# EAGLE design Wind_enc (EAGLE 6.3)
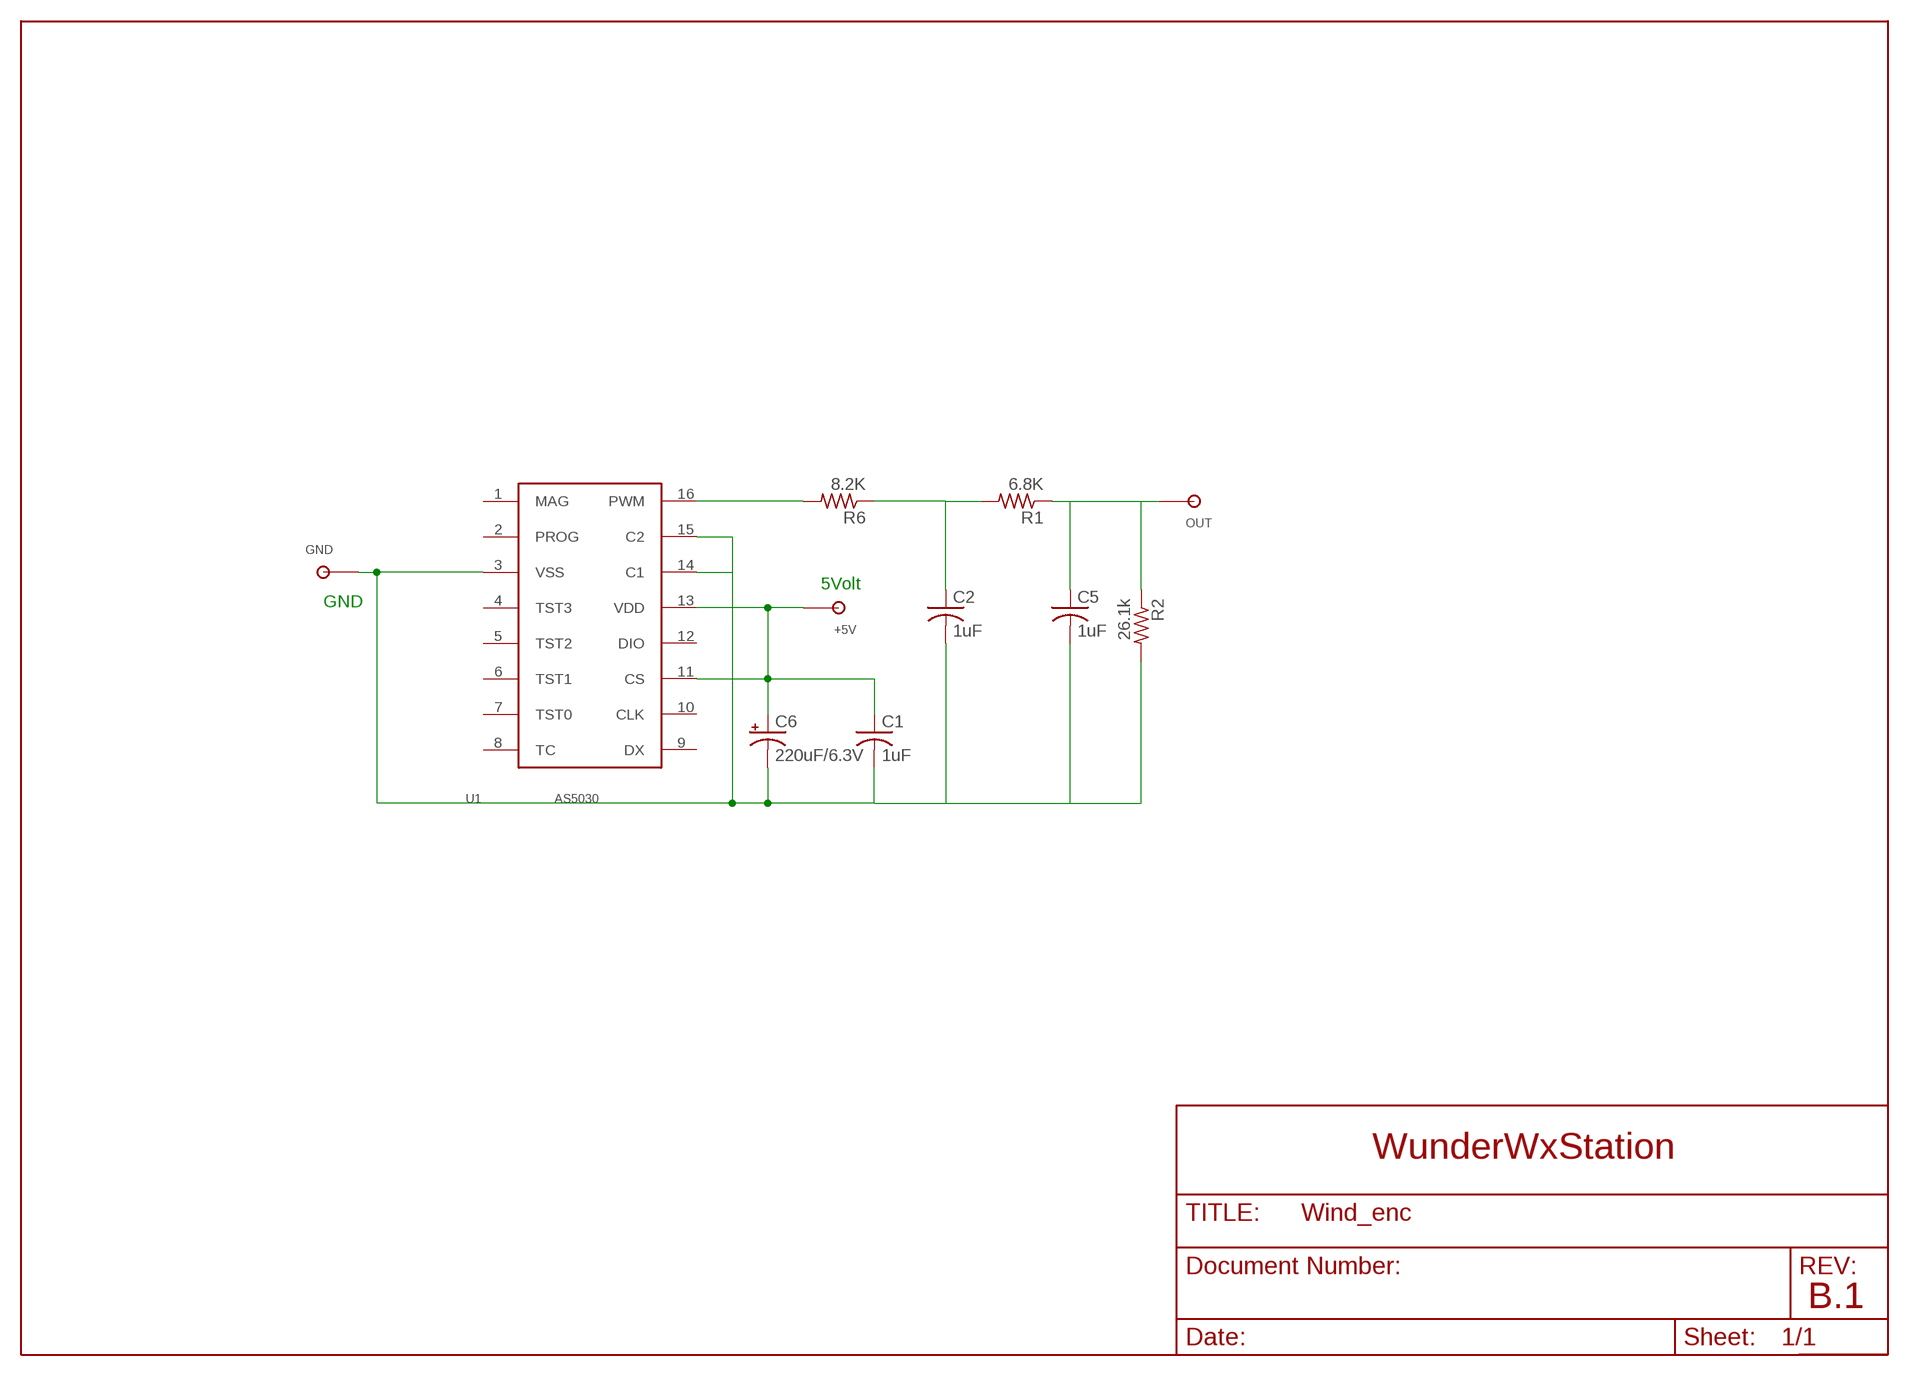
[diagram p0: schematic, sheet 1]

## Parts
+5V  TPSOL  [TP_SOL]
C1  1uF  C-USC0805K  [C0805K]
C2  1uF  C-USC0805K  [C0805K]
C5  1uF  C-USC0805K  [C0805K]
C6  220uF/6.3V  CPOL-USSMCD  [SMC_D]
GND  TPSOL  [TP_SOL]
OUT  TPSOL  [TP_SOL]
R1  6.8K  R-US_R0603  [R0603]
R2  26.1k  R-US_R0603  [R0603]
R6  8.2K  R-US_R0603  [R0603]
U1  AS5030  [TSSOP16]

## Nets
N$1: +5V.P$1 C1.1 C6.+ U1.11(CS) U1.13(VDD)
N$2: C1.2 C2.2 C5.2 C6.- GND.P$1 R2.2 U1.3(VSS) U1.14(C1) U1.15(C2)
N$3: C5.1 OUT.P$1 R1.1 R2.1
N$22: C2.1 R1.2 R6.1
N$23: R6.2 U1.16(PWM)
Unconnected: U1.1(MAG) U1.2(PROG) U1.4(TST3) U1.5(TST2) U1.6(TST1) U1.7(TST0) U1.8(TC) U1.9(DX) U1.10(CLK) U1.12(DIO)

## Notes on the sheet
- 5Volt
- GND
- WunderWxStation
- B.1

## Library data of the parts
+5V GND OUT = wifi_WX:TP
C1 C2 C5 = rcl:C-US: CAPACITOR, American symbol
C6 = rcl:CPOL-US: POLARIZED CAPACITOR, American symbol
R1 R2 R6 = rcl:R-US_: RESISTOR, American symbol
U1 = Stofer:AS5030

## Board
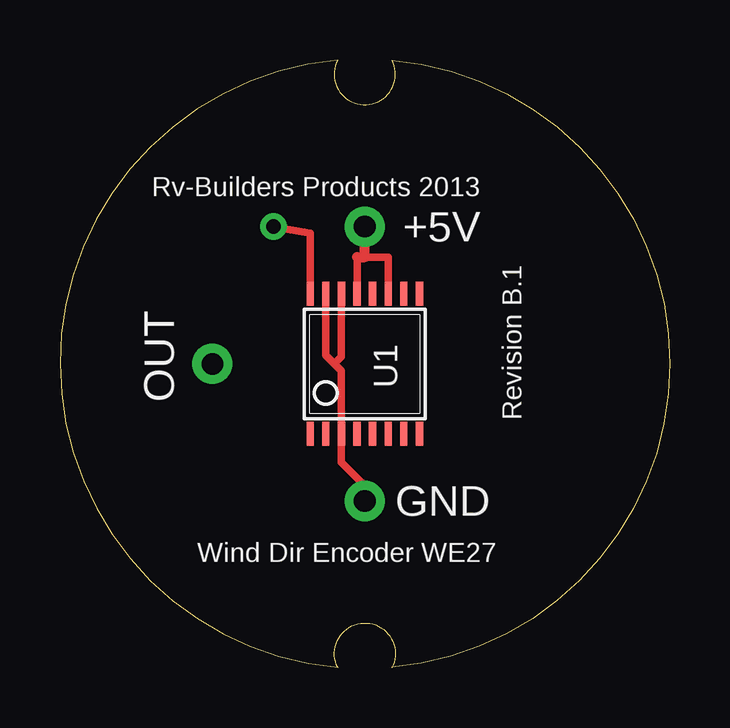
[diagram p1: board, top side]
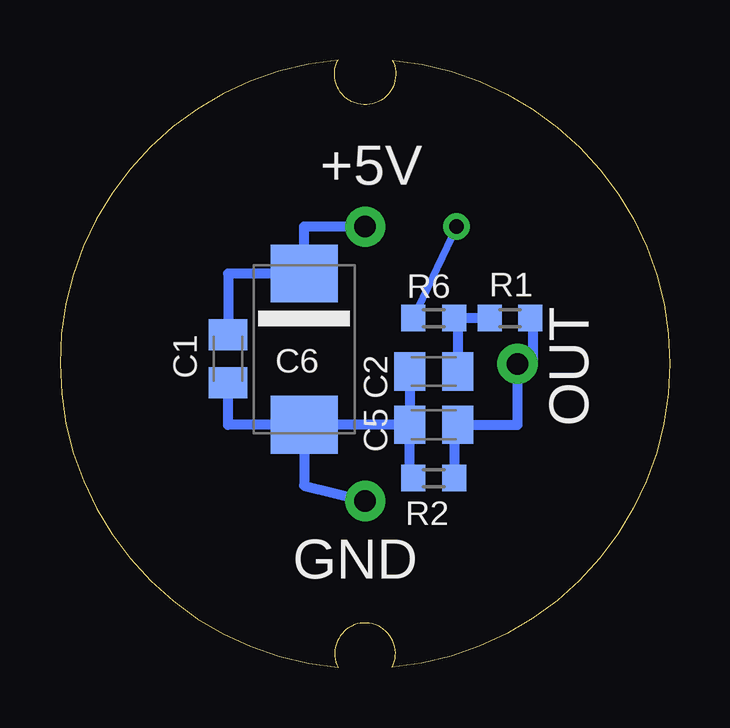
[diagram p2: board, bottom side, seen from below]

Size 25.41 x 25.32 mm. Coordinates in mm from the lower left corner, seen from the top.
Outline: 11.57,25.32 arc170 11.58,0.02
Outline: 11.57,25.32 arc235 13.83,25.32
Outline: 13.83,25.32 arc-170 13.82,0.01
Outline: 11.57,0.02 arc-235 13.83,0
Copper layers (1*16): Top 0.035mm / dielectric 1.5mm / Bottom 0.035mm
Design rules "sparkfun": minimum track width 8mil, minimum drill 20mil, track to track 8mil, track to pad 8mil, pad to pad 8mil, via to via 8mil, smd to smd 8mil, copper to edge 10mil, drill to drill 8mil, minimum pad ring 12mil, minimum via ring 10mil, stop-mask expansion 4mil, vias tented up to drill 25mil, thermal gap 10mil

### Footprints (pad centres in the part's own frame; a part is rotated, then mirrored left to right if it is on the bottom)
TP_SOL = drill 0.9 pad 1.676: P$1 0,0
C0805K = smd 1.3 x 1.6: 1 -1,0; 2 1,0
SMC_D = smd 2.4 x 2.8: + -3.15,0; - 3.15,0
R0603 = smd 1 x 1.1: 1 -0.85,0; 2 0.85,0
TSSOP16 = smd 0.305 x 0.991: 1 -2.275,-2.918; 2 -1.625,-2.918; 3 -0.975,-2.918; 4 -0.325,-2.918; 5 0.325,-2.918; 6 0.975,-2.918; 7 1.625,-2.918; 8 2.275,-2.918; 9 2.275,2.918; 10 1.625,2.918; 11 0.975,2.918; 12 0.325,2.918; 13 -0.325,2.918; 14 -0.975,2.918; 15 -1.625,2.918; 16 -2.275,2.918

### Placement (x,y rotation side)
+5V  12.7,18.38 0 top
C1  18.41,12.88 270 bottom
C2  9.84,12.35 180 bottom
C5  9.84,10.12 180 bottom
C6  330uF/6.3V  [SMC_D]  15.24,13.27 270 bottom
GND  12.7,6.95 0 top
OUT  6.35,12.66 0 top
R1  6.67,14.57 180 bottom
R2  9.84,7.9 180 bottom
R6  9.84,14.57 180 bottom
U1  12.7,12.66 0 top

### Tracks (layer width: path | path; a pad name or v marks a point on that pad's centre or on a via)
N$1
  Top 0.254: U1.13
  Top 0.305: U1.11 13.67,17.11 12.7,17.11 | 12.38,17.11 U1.13
  Top 0.406: 12.38,17.11 12.7,17.11 +5V.P$1
  Bottom 0.406: C1.1 18.41,16.42 C6.+ 15.24,18.38 +5V.P$1
N$2
  Top 0.305: U1.15 11.07,13.02 11.43,12.66 | U1.14 11.72,12.96 11.43,12.66 | 11.43,12.66 11.72,12.37 U1.3 11.72,8.56 12.7,7.58
  Top 0.406: 12.7,7.58 GND.P$1
  Bottom 0.406: C6.- 18.41,10.12 C1.2 | C5.2 C6.- | C6.- 15.24,7.58 GND.P$1 | R2.2 10.84,8.22 C5.2 | C2.2 C5.2
N$3
  Bottom 0.406: R2.1 8.99,10.12 C5.1 6.35,10.12 OUT.P$1 5.71,12.66 5.71,14.57 R1.1
N$22
  Bottom 0.406: R1.2 R6.1 8.84,14.57 C2.1
N$23  (via drill 0.6)
  Top 0.254: 10.41,15.59 U1.16
  Top 0.305: U1.16 10.42,18.11 v8.89,18.38
  Bottom 0.305: v8.89,18.38 R6.2

### Text on the board
tPlace: Rv-Builders Products 2013 | +5V | Revision B.1 | OUT | GND | Wind Dir Encoder WE27